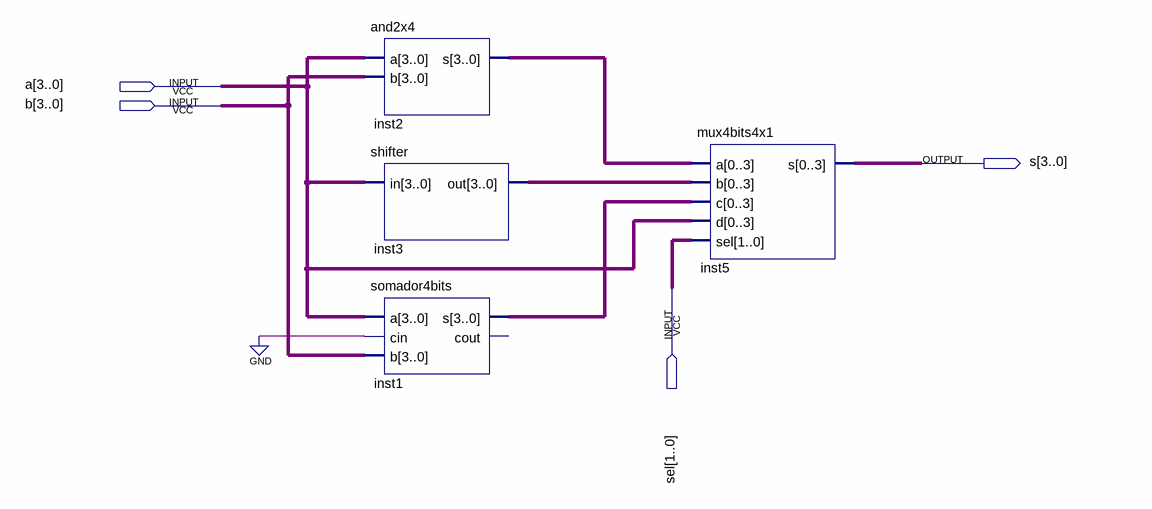
[diagram p0: schematic sheet]
// Quartus schematic ula.bdf as structural Verilog: 4 symbols, 4 pins
module ula (
  input  [3:0] a,
  input  [3:0] b,
  input  [1:0] sel,
  output [3:0] s
);

  wire [3:0] inst1_s, inst2_s, inst3_out;

  and2x4 inst2 (.a(a), .b(b), .s(inst2_s));
  shifter inst3 (.in(a), .out(inst3_out));
  somador4bits inst1 (.a(a), .cin(1'b0), .b(b), .s(inst1_s));  // open: cout
  mux4bits4x1 inst5 (.a(inst2_s), .b(inst3_out), .c(inst1_s), .d(a), .sel(sel), .s(s));
endmodule
